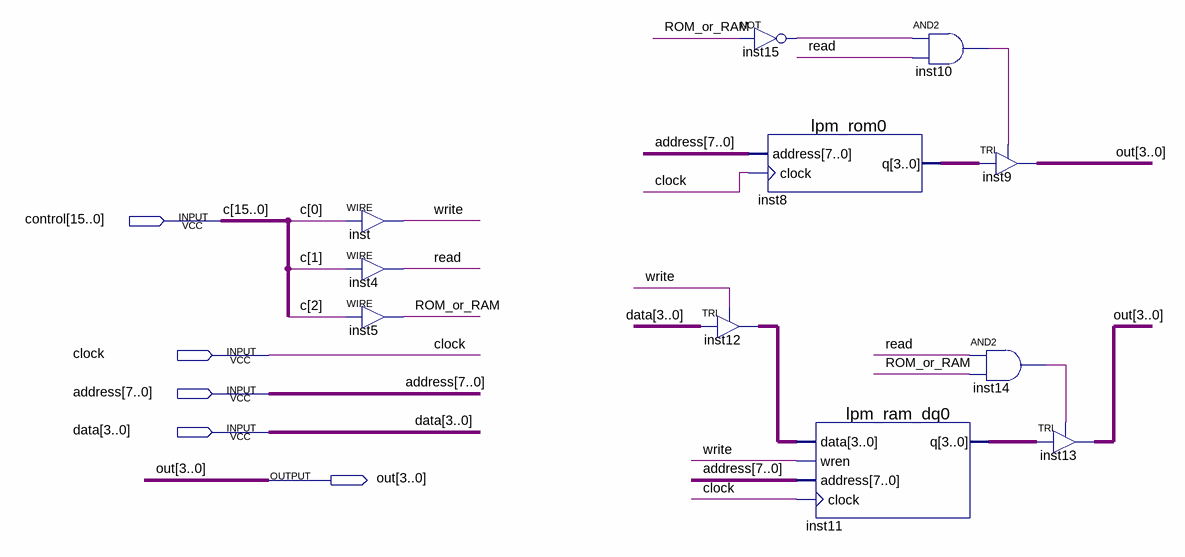
[diagram p0: schematic sheet]
// Quartus schematic memory.bdf as structural Verilog: 11 symbols, 5 pins
module memory (
  input  [15:0] control,
  input  clock,
  input  [7:0] address,
  input  [3:0] data,
  output [3:0] out
);

  wire inst10_out, inst14_out, inst15_out, read, ROM_or_RAM, write;
  wire [3:0] inst8_q, inst11_q, inst12_out;

  assign write = control[0];  // WIRE inst
  assign read = control[1];  // WIRE inst4
  assign ROM_or_RAM = control[2];  // WIRE inst5
  not inst15 (inst15_out, ROM_or_RAM);
  lpm_rom0 inst8 (.address(address), .clock(clock), .q(inst8_q));
  TRI inst12[3:0] (.IN(data), .OE(write), .OUT(inst12_out));
  lpm_ram_dq0 inst11 (.data(inst12_out), .wren(write), .address(address), .clock(clock), .q(inst11_q));
  and inst10 (inst10_out, inst15_out, read);
  TRI inst9[3:0] (.IN(inst8_q), .OE(inst10_out), .OUT(out));
  and inst14 (inst14_out, read, ROM_or_RAM);
  TRI inst13[3:0] (.IN(inst11_q), .OE(inst14_out), .OUT(out));

  // Other names for the same wires on the sheet: c[15:0] = control
endmodule
